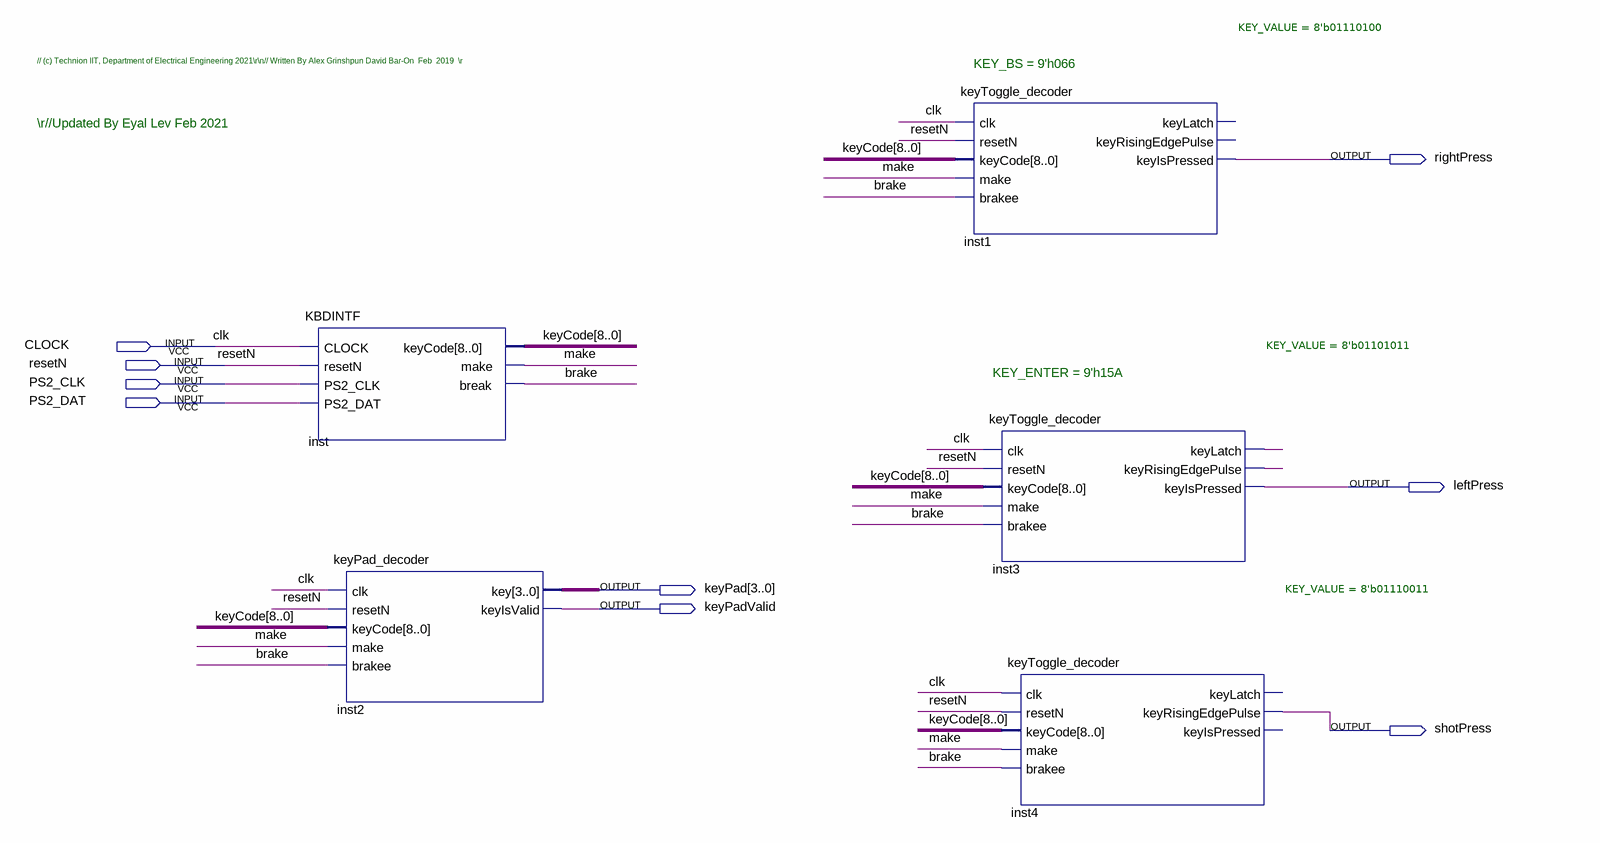
[diagram p0: schematic sheet]
// Quartus schematic KEYBOARD_INTERFACE.bdf as structural Verilog: 5 symbols, 9 pins
module KEYBOARD_INTERFACE (
  input  CLOCK,
  input  resetN,
  input  PS2_CLK,
  input  PS2_DAT,
  output rightPress,
  output leftPress,
  output [3:0] keyPad,
  output keyPadValid,
  output shotPress
);

  wire brake, inst3_keylatch, inst3_keyrisingedgepulse, make;
  wire [8:0] keyCode;

  KBDINTF inst (
    .CLOCK(CLOCK), .resetN(resetN), .PS2_CLK(PS2_CLK), .PS2_DAT(PS2_DAT), .keyCode(keyCode), .make(make),
    .\break (brake));
  keyPad_decoder inst2 (
    .clk(CLOCK), .resetN(resetN), .keyCode(keyCode), .make(make), .brakee(brake), .key(keyPad),
    .keyIsValid(keyPadValid));
  keyToggle_decoder #(.KEY_VALUE(8'b01110100)) inst1 (
    .clk(CLOCK), .resetN(resetN), .keyCode(keyCode), .make(make), .brakee(brake), .keyIsPressed(rightPress));  // open: keyLatch, keyRisingEdgePulse
  keyToggle_decoder #(.KEY_VALUE(8'b01101011)) inst3 (
    .clk(CLOCK), .resetN(resetN), .keyCode(keyCode), .make(make), .brakee(brake), .keyLatch(inst3_keylatch),
    .keyRisingEdgePulse(inst3_keyrisingedgepulse), .keyIsPressed(leftPress));
  keyToggle_decoder #(.KEY_VALUE(8'b01110011)) inst4 (
    .clk(CLOCK), .resetN(resetN), .keyCode(keyCode), .make(make), .brakee(brake),
    .keyRisingEdgePulse(shotPress));  // open: keyLatch, keyIsPressed

  // Other names for the same wires on the sheet: clk = CLOCK

  // Notes on the sheet:
  //   // (c) Technion IIT, Department of Electrical Engineering 2021\r\n// Written By Alex Grinshpun David Bar-On  Feb  2019  \r
  //   KEY_BS = 9'h066
  //   \r//Updated By Eyal Lev Feb 2021
  //   KEY_ENTER = 9'h15A
endmodule
